# Altium project Shelf_System_F.PrjPcb
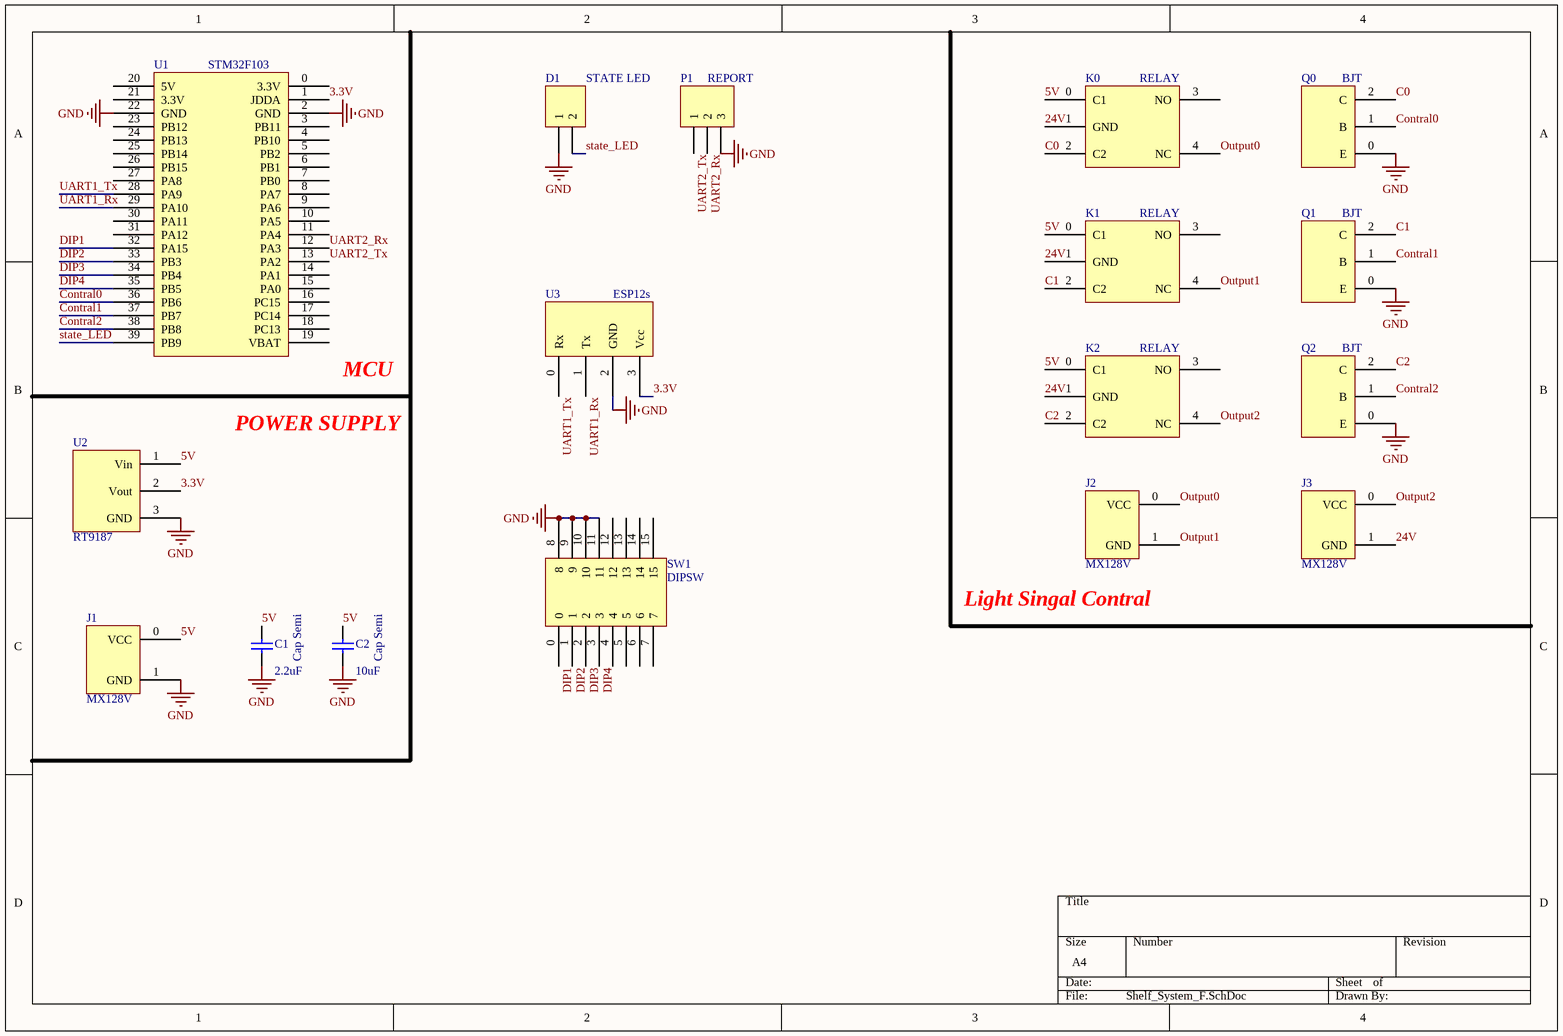
[diagram p0: Shelf_System_F.SchDoc]
1 sheet, 17 parts. Net scope: global (net labels, ports and power ports of the same name join across sheets).
Board file: Shelf_System_F.PcbDoc

## Sheet Shelf_System_F.SchDoc
size A4; SheetNumber: 1; SheetTotal: 1

### Parts
C1  Cap Semi  value 2.2uF  [1608[0603]]
C2  Cap Semi  value 10uF  [1608[0603]]
D1  STATE LED  [HDR1X2]
J1  MX128V  [MX128V]
J2  MX128V  [MX128V]
J3  MX128V  [MX128V]
K0  RELAY  [RELAY]
K1  RELAY  [RELAY]
K2  RELAY  [RELAY]
P1  REPORT  [HDR1X3]
Q0  BJT  [bjt]
Q1  BJT  [bjt]
Q2  BJT  [bjt]
SW1  DIPSW  [DIPSW]
U1  STM32F103  [STM32F103]
U2  RT9187  [RT9187]
U3  ESP12s  [ESP12s]

### Nets
GND: C1.1 C2.1 D1.1 J1.1(GND) P1.3 Q0.0(E) Q1.0(E) Q2.0(E) SW1.8 SW1.9 SW1.10 SW1.11 U1.2(GND) U1.22(GND) U2.3(GND) U3.2(GND)
3.3V: U1.1(JDDA) U2.2(Vout) U3.3(Vcc)
5V: C1.2 C2.2 J1.0(VCC) K0.0(C1) K1.0(C1) K2.0(C1) U2.1(Vin)
24V: J3.1(GND) K0.1(GND) K1.1(GND) K2.1(GND)
C0: K0.2(C2) Q0.2(C)
C1: K1.2(C2) Q1.2(C)
C2: K2.2(C2) Q2.2(C)
Contral0: Q0.1(B) U1.36(PB6)
Contral1: Q1.1(B) U1.37(PB7)
Contral2: Q2.1(B) U1.38(PB8)
DIP1: SW1.0 U1.32(PA15)
DIP2: SW1.1 U1.33(PB3)
DIP3: SW1.2 U1.34(PB4)
DIP4: SW1.3 U1.35(PB5)
Output0: J2.0(VCC) K0.4(NC)
Output1: J2.1(GND) K1.4(NC)
Output2: J3.0(VCC) K2.4(NC)
state_LED: D1.2 U1.39(PB9)
UART1_Rx: U1.29(PA10) U3.1(Tx)
UART1_Tx: U1.28(PA9) U3.0(Rx)
UART2_Rx: P1.2 U1.12(PA3)
UART2_Tx: P1.1 U1.13(PA2)

Not connected (* = marked no-connect by the designer): K0 3(NO); K1 3(NO); K2 3(NO); SW1 4 5 6 7 12 13 14 15; U1 0(3.3V) 3(PB11) 4(PB10) 5(PB2) 6(PB1) 7(PB0) 8(PA7) 9(PA6) 10(PA5) 11(PA4) 14(PA1) 15(PA0) 16(PC15) 17(PC14) 18(PC13) 19(VBAT) 20(5V) 21(3.3V) 23(PB12) 24(PB13) 25(PB14) 26(PB15) 27(PA8) 30(PA11) 31(PA12)

### Notes on the sheet
- MCU
- POWER SUPPLY
- (near J2) Light Singal Contral

### Library data of the parts
C1 C2 = Cap Semi: Capacitor (Semiconductor SIM Model); Published: 8-Jun-2000; LatestRevisionDate: 29-May-2009; LatestRevisionNote: IPC-7351 Footprint Added.; PackageReference: C1206; Publisher: Altium Limited; PackageDescription: Chip Capacitor
D1 = Header 2: Header, 2-Pin; LatestRevisionDate: 17-Jul-2002; LatestRevisionNote: Re-released for DXP Platform.; Publisher: Altium Limited
P1 = Header 3: Header, 3-Pin; LatestRevisionDate: 17-Jul-2002; LatestRevisionNote: Re-released for DXP Platform.; Publisher: Altium Limited